# Altium schematic sheet MCU1.1.SchDoc
size A3
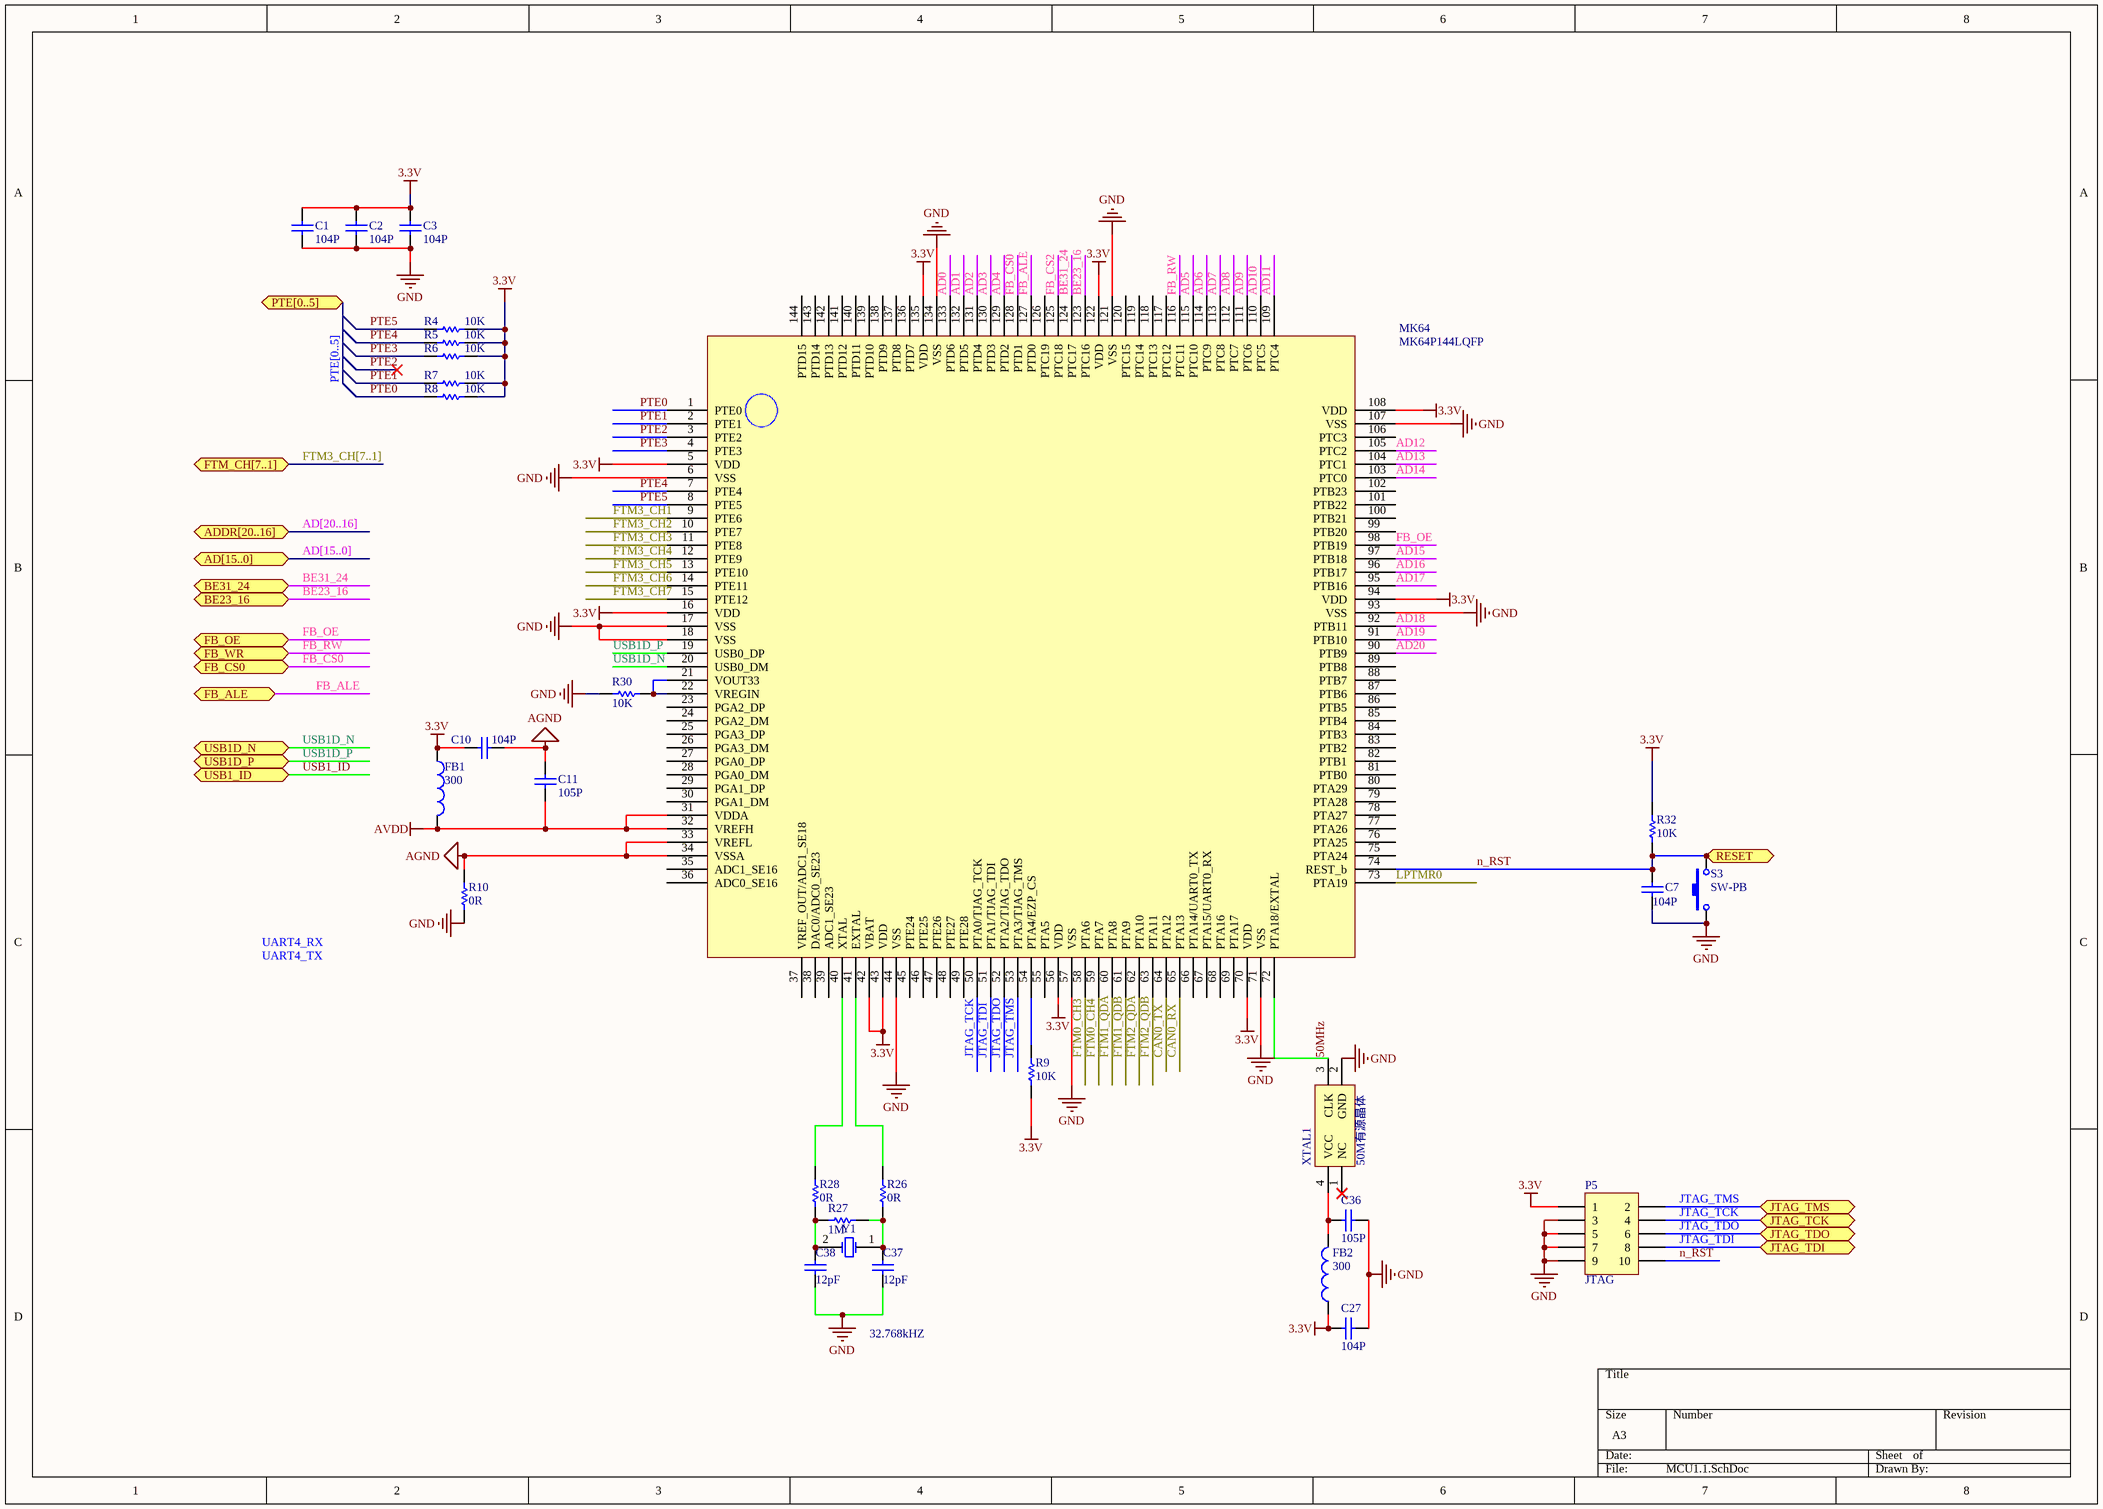
[diagram p0: MCU1.1.SchDoc]

## Parts
C1  value 104P  [1608[0603]]  (hidden comment: Cap)
C2  value 104P  [1608[0603]]  (hidden comment: Cap)
C3  value 104P  [1608[0603]]  (hidden comment: Cap)
C7  value 104P  [1608[0603]]  (hidden comment: Cap)
C10  value 104P  [1608[0603]]  (hidden comment: Cap)
C11  value 105P  [1608[0603]]  (hidden comment: Cap)
C27  value 104P  [1608[0603]]  (hidden comment: Cap)
C36  value 105P  [1608[0603]]  (hidden comment: Cap)
C37  value 12pF  [1608[0603]]  (hidden comment: Cap)
C38  value 12pF  [1608[0603]]  (hidden comment: Cap)
FB1  value 300  [1608[0603]]  (hidden comment: Inductor)
FB2  value 300  [1608[0603]]  (hidden comment: Inductor)
MK64  MK64P144LQFP  [LQFP-144]
P5  JTAG  [HDR2X5]
R4  value 10K  [1608[0603]]  (hidden comment: Res)
R5  value 10K  [1608[0603]]  (hidden comment: Res)
R6  value 10K  [1608[0603]]  (hidden comment: Res)
R7  value 10K  [1608[0603]]  (hidden comment: Res)
R8  value 10K  [1608[0603]]  (hidden comment: Res)
R9  value 10K  [1608[0603]]  (hidden comment: Res)
R10  value 0R  [1608[0603]]  (hidden comment: Res)
R26  value 0R  [1608[0603]]  (hidden comment: Res)
R27  value 1M  [1608[0603]]  (hidden comment: Res)
R28  value 0R  [1608[0603]]  (hidden comment: Res)
R30  value 10K  [1608[0603]]  (hidden comment: Res)
R32  value 10K  [1608[0603]]  (hidden comment: Res)
S3  SW-PB  [key 3*4*2]
XTAL1  50M有源晶体  [XTAL7_3225]
Y1  32.768kHZ  [3215]

## Ports
AD[15..0], ADDR[20..16], BE23_16, BE31_24, FB_ALE, FB_CS0, FB_OE, FB_WR, FTM_CH[7..1], JTAG_TCK, JTAG_TDI, JTAG_TDO, JTAG_TMS, PTE[0..5], RESET, USB1_ID, USB1D_N, USB1D_P

## Nets
3.3V: C1.2 C2.2 C3.2 C10.1 C27.2 FB1.1 FB2.1 MK64.5(VDD) MK64.16(VDD) MK64.42(VBAT) MK64.43(VDD) MK64.56(VDD) MK64.70(VDD) MK64.94(VDD) MK64.108(VDD) MK64.122(VDD) MK64.135(VDD) P5.1 R4.1 R5.1 R6.1 R7.1 R8.1 R9.1 R32.1
AGND: C10.2 C11.2 MK64.33(VREFL) MK64.34(VSSA) R10.2
AVDD: C11.1 FB1.2 MK64.31(VDDA) MK64.32(VREFH)
GND: C1.1 C2.1 C3.1 C7.1 C27.1 C36.1 C37.1 C38.1 MK64.6(VSS) MK64.17(VSS) MK64.18(VSS) MK64.44(VSS) MK64.57(VSS) MK64.71(VSS) MK64.93(VSS) MK64.107(VSS) MK64.121(VSS) MK64.134(VSS) P5.3 P5.5 P5.7 P5.9 R10.1 R30.1 S3.1 XTAL1.2(GND)
50MHz: MK64.72(PTA18/EXTAL) XTAL1.3(CLK)
AD0: MK64.133(PTD6)
AD1: MK64.132(PTD5)
AD2: MK64.131(PTD4)
AD3: MK64.130(PTD3)
AD4: MK64.129(PTD2)
AD5: MK64.115(PTC10)
AD6: MK64.114(PTC9)
AD7: MK64.113(PTC8)
AD8: MK64.112(PTC7)
AD9: MK64.111(PTC6)
AD10: MK64.110(PTC5)
AD11: MK64.109(PTC4)
AD12: MK64.105(PTC2)
AD13: MK64.104(PTC1)
AD14: MK64.103(PTC0)
AD15: MK64.97(PTB18)
AD16: MK64.96(PTB17)
AD17: MK64.95(PTB16)
AD18: MK64.92(PTB11)
AD19: MK64.91(PTB10)
AD20: MK64.90(PTB9)
BE23_16: MK64.123(PTC16) ; port BE23_16
BE31_24: MK64.124(PTC17) ; port BE31_24
CAN0_RX: MK64.65(PTA13)
CAN0_TX: MK64.64(PTA12)
FB_ALE: MK64.127(PTD0) ; port FB_ALE
FB_CS0: MK64.128(PTD1) ; port FB_CS0
FB_CS2: MK64.125(PTC18)
FB_OE: MK64.98(PTB19) ; port FB_OE
FB_RW: MK64.116(PTC11) ; port FB_WR
FTM0_CH3: MK64.58(PTA6)
FTM0_CH4: MK64.59(PTA7)
FTM1_QDA: MK64.60(PTA8)
FTM1_QDB: MK64.61(PTA9)
FTM2_QDA: MK64.62(PTA10)
FTM2_QDB: MK64.63(PTA11)
FTM3_CH1: MK64.9(PTE6)
FTM3_CH2: MK64.10(PTE7)
FTM3_CH3: MK64.11(PTE8)
FTM3_CH4: MK64.12(PTE9)
FTM3_CH5: MK64.13(PTE10)
FTM3_CH6: MK64.14(PTE11)
FTM3_CH7: MK64.15(PTE12)
JTAG_TCK: MK64.50(PTA0/TJAG_TCK) P5.4 ; port JTAG_TCK
JTAG_TDI: MK64.51(PTA1/TJAG_TDI) P5.8 ; port JTAG_TDI
JTAG_TDO: MK64.52(PTA2/TJAG_TDO) P5.6 ; port JTAG_TDO
JTAG_TMS: MK64.53(PTA3/TJAG_TMS) P5.2 ; port JTAG_TMS
LPTMR0: MK64.73(PTA19)
n_RST: C7.2 MK64.74(REST_b) P5.10 R32.2 S3.2 ; port RESET
PTE0: MK64.1(PTE0) R8.2
PTE1: MK64.2(PTE1) R7.2
PTE2: MK64.3(PTE2)
PTE3: MK64.4(PTE3) R6.2
PTE4: MK64.7(PTE4) R5.2
PTE5: MK64.8(PTE5) R4.2
USB1_ID: port USB1_ID
USB1D_N: MK64.20(USB0_DM) ; port USB1D_N
USB1D_P: MK64.19(USB0_DP) ; port USB1D_P
NetC36_2: C36.2 FB2.2 XTAL1.4(VCC)
NetC37_2: C37.2 R26.1 R27.1 Y1.1(OSC1)
NetC38_2: C38.2 R27.2 R28.1 Y1.2(OSC2)
NetMK64_21: MK64.21(VOUT33) MK64.22(VREGIN) R30.2
NetMK64_40: MK64.40(XTAL) R28.2
NetMK64_41: MK64.41(EXTAL) R26.2
NetMK64_54: MK64.54(PTA4/EZP_CS) R9.2

Not connected (* = marked no-connect by the designer): MK64 23(PGA2_DP) 24(PGA2_DM) 25(PGA3_DP) 26(PGA3_DM) 27(PGA0_DP) 28(PGA0_DM) 29(PGA1_DP) 30(PGA1_DM) 35(ADC1_SE16) 36(ADC0_SE16) 37(VREF_OUT/ADC1_SE18) 38(DAC0/ADC0_SE23) 39(ADC1_SE23) 45(PTE24) 46(PTE25) 47(PTE26) 48(PTE27) 49(PTE28) 55(PTA5) 66(PTA14/UART0_TX) 67(PTA15/UART0_RX) 68(PTA16) 69(PTA17) 75(PTA24) 76(PTA25) 77(PTA26) 78(PTA27) 79(PTA28) 80(PTA29) 81(PTB0) 82(PTB1) 83(PTB2) 84(PTB3) 85(PTB4) 86(PTB5) 87(PTB6) 88(PTB7) 89(PTB8) 99(PTB20) 100(PTB21) 101(PTB22) 102(PTB23) 106(PTC3) 117(PTC12) 118(PTC13) 119(PTC14) 120(PTC15) 126(PTC19) 136(PTD7) 137(PTD8) 138(PTD9) 139(PTD10) 140(PTD11) 141(PTD12) 142(PTD13) 143(PTD14) 144(PTD15); XTAL1 1(NC)*

## Buses and harness runs
bus AD[15..0] = port AD[15..0]
bus AD[20..16] = port ADDR[20..16]
bus FTM3_CH[7..1] = port FTM_CH[7..1]
bus PTE[0..5] = port PTE[0..5]

## Notes on the sheet
- Labels drawn without touching a wire or pin: UART4_RX, UART4_TX

## Library data of the parts
C1-C3 C7 C10 C11 C27 C36-C38 = Cap: 贴片电容; Published: 8-Jun-2000; LatestRevisionDate: 17-Jul-2002; LatestRevisionNote: Re-released for DXP Platform.; PackageReference: RAD-0.3; Publisher: Altium Limited
FB1 FB2 = Inductor: Code_IEC: 1005; Published: 8-Jun-2000; LatestRevisionDate: 29-May-2009; LatestRevisionNote: IPC-7351 Footprint Added.; PackageReference: 0402-A; Publisher: Altium Limited; PackageDescription: Chip Inductor; Code_JEITA: 0402
P5 = Header 5X2: Header, 5-Pin, Dual row; LatestRevisionDate: 17-Jul-2002; LatestRevisionNote: Re-released for DXP Platform.; Publisher: Altium Limited
R4-R10 R26-R28 R30 R32 = Res: 贴片电阻; Published: 8-Jun-2000; LatestRevisionDate: 17-Jul-2002; LatestRevisionNote: Re-released for DXP Platform.; PackageReference: AXIAL-0.3; Publisher: Altium Limited
S3 = SW-PB: Switch
XTAL1 = 有源晶体
Y1 = XTAL: 晶体振荡器; Published: 8-Jun-2000; LatestRevisionDate: 17-Jul-2002; LatestRevisionNote: Re-released for DXP Platform.; PackageReference: R38; Publisher: Altium Limited